# Altium schematic sheet Audio_Input_Digitial_Mic.SchDoc: MEMS Microphones
size 279 x 215 mm; DrawnBy: Connor Dack; Engineer: Connor Dack; DocumentNumber: 10; Revision: 1.0; SheetNumber: 10; SheetTotal: 11
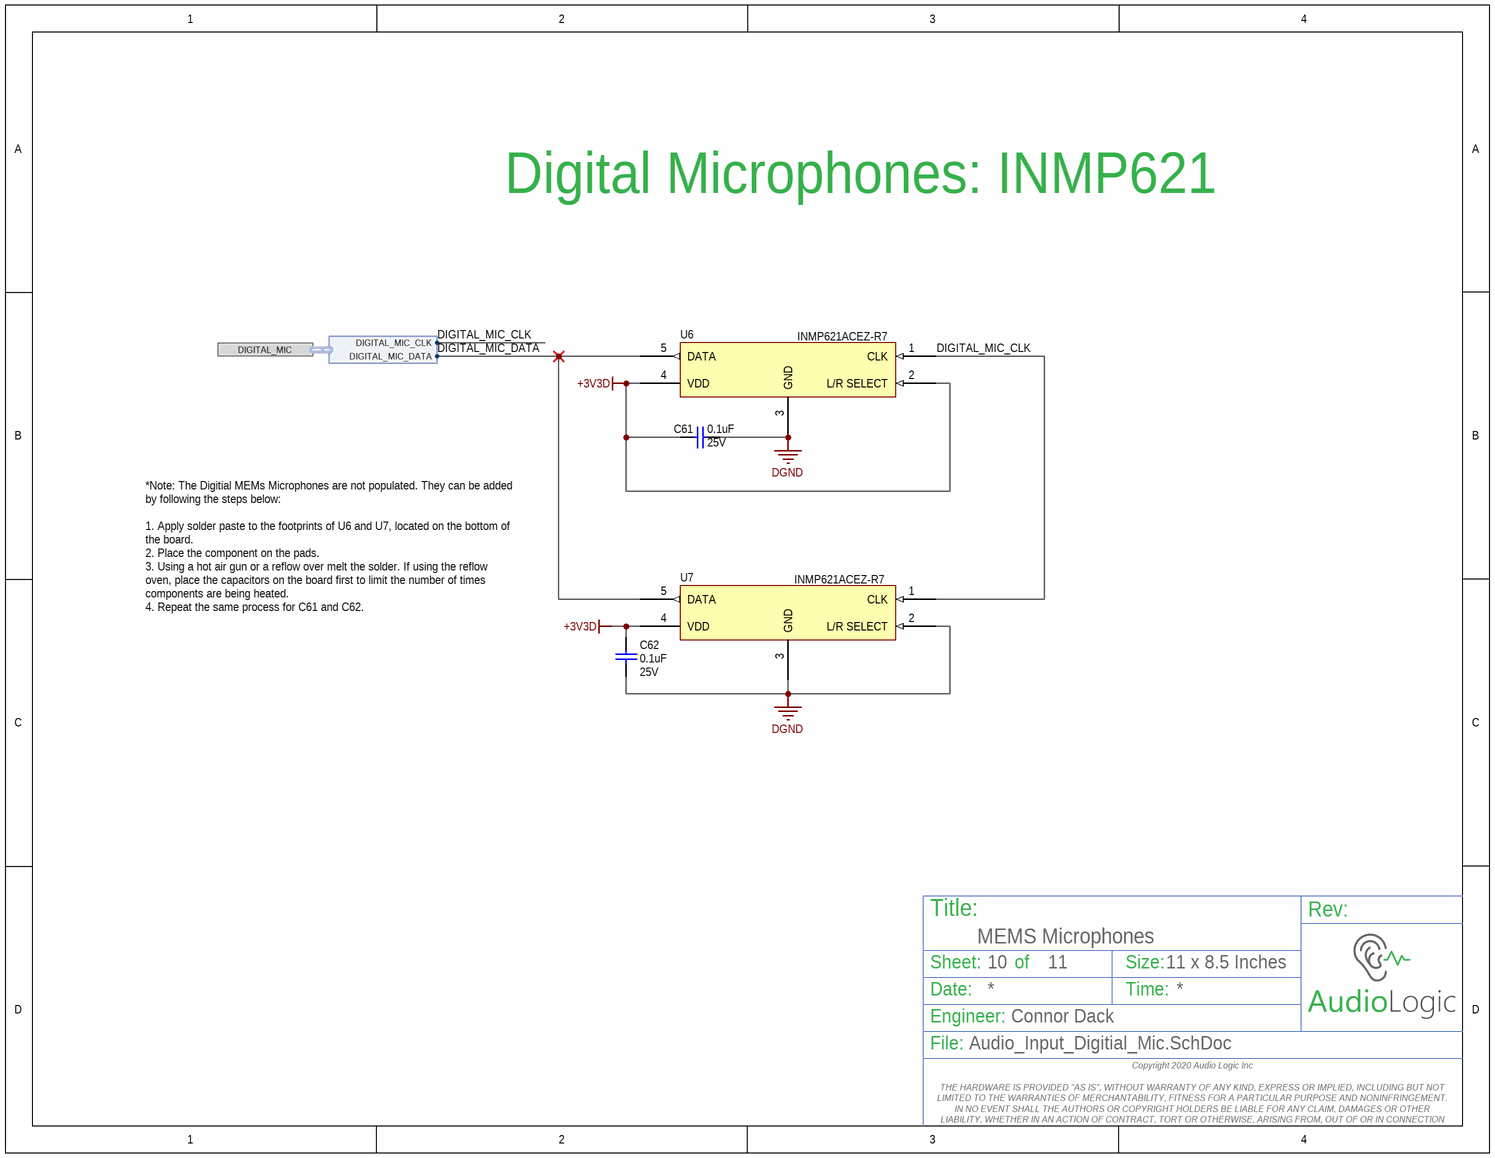
[diagram p0: Audio_Input_Digitial_Mic.SchDoc]

## Parts
C61  Voltage Rating: 25V  Capacitance: 0.1uF  [3-0603_L_DNP]  (hidden comment: CGA3E2X7R1E104K080AA)
C62  Voltage Rating: 25V  Capacitance: 0.1uF  [3-0603_L_DNP]  (hidden comment: CGA3E2X7R1E104K080AA)
U6  Manufacturer Part Number: INMP621ACEZ-R7  [INMP621_DNP]  (hidden comment: INMP621)
U7  Manufacturer Part Number: INMP621ACEZ-R7  [INMP621_DNP]  (hidden comment: INMP621)

## Ports
DIGITAL_MIC (harness Digital_Mic)

## Harnesses
Digital_Mic: DIGITAL_MIC_CLK, DIGITAL_MIC_DATA

## Nets
+3V3D: C61.2 C62.1 U6.2(L/R_SELECT) U6.4(VDD) U7.4(VDD)
DGND: C61.1 C62.2 U6.3(GND) U7.2(L/R_SELECT) U7.3(GND)
DIGITAL_MIC_CLK: U6.1(CLK) U7.1(CLK) ; port DIGITAL_MIC.DIGITAL_MIC_CLK
DIGITAL_MIC_DATA: U6.5(DATA) U7.5(DATA) ; port DIGITAL_MIC.DIGITAL_MIC_DATA

## Notes on the sheet
- Digital Microphones: INMP621
- *Note: The Digitial MEMs Microphones are not populated. They can be added by following the steps below:
  1. Apply solder paste to the footprints of U6 and U7, located on the bottom of the board.
  2. Place the component on the pads.
  3. Using a hot air gun or a reflow over melt the solder. If using the reflow oven, place the capacitors on the board first to limit the number of times components are being heated.
  4. Repeat the same process for C61 and C62.
- Title:
- Sheet:
- of
- Size:
- 11 x 8.5 Inches
- Rev:
- Date:
- Engineer:
- Time:
- File:
- Copyright 2020 Audio Logic Inc
  THE HARDWARE IS PROVIDED "AS IS", WITHOUT WARRANTY OF ANY KIND, EXPRESS OR IMPLIED, INCLUDING BUT NOT LIMITED TO THE WARRANTIES OF MERCHANTABILITY, FITNESS FOR A PARTICULAR PURPOSE AND NONINFRINGEMENT. IN NO EVENT SHALL THE AUTHORS OR COPYRIGHT HOLDERS BE LIABLE FOR ANY CLAIM, DAMAGES OR OTHER LIABILITY, WHETHER IN AN ACTION OF CONTRACT, TORT OR OTHERWISE, ARISING FROM, OUT OF OR IN CONNECTION WITH THE HARDWARE OR THE USE OR OTHER DEALINGS IN THE HARDWARE.

## Library data of the parts
C61 C62 = CGA3E2X7R1E104K080AA: CAP CER 0.1UF 25V X7R 0603; Manufacturer: TDK; Tolerance: 10%; ComponentLink1URL: https://datasheet.ciiva.com/24218/cga3e2x7r1h332k080aa-266003-24218741.pdf; ComponentLink1Description: https://datasheet.ciiva.com/24218/cga3e2x7r1h332k080aa-266003-24218741.pdf; Supplier 1: Digi-Key; Manufacturer Part Number: CGA3E2X7R1E104K080AA; Stock 1: 170098; Pricing 1: 1=0.1, 10=0.063, 100=0.0279, 500=0.0199, 1000=0.0156 (USD); Mount: Surface Mount; Case/Package: 0603; Weight: 7.1E-05oz; Case Code (Metric): 1608; Case Code (Imperial): 0603; Min Operating Temperature: -55°C; Max Operating Temperature: 125°C; Packaging: Tape and Reel; Package Quantity: 1; Voltage Rating (DC): 25V; Dielectric: X7R; Termination: SMD/SMT; Composition: Ceramic; Length: 1.6mm; Height: 0.8mm; Width: 0.031inch; Thickness: 0.035inch; Depth: 0.8mm; REACH SVHC: No SVHC; Lead Free: Lead Free; ComponentLink2URL: https://datasheet.ciiva.com/22725/1735392-22725638.pdf; ComponentLink2Description: https://datasheet.ciiva.com/22725/1735392-22725638.pdf; ComponentLink3URL: https://datasheet.ciiva.com/24220/cga3e2x7r1e104k080aa-265934-24220022.pdf; ComponentLink3Description: https://datasheet.ciiva.com/24220/cga3e2x7r1e104k080aa-265934-24220022.pdf; ComponentLink4URL: https://datasheet.ciiva.com/22725/1735392-22725639.pdf; ComponentLink4Description: https://datasheet.ciiva.com/22725/1735392-22725639.pdf; ComponentLink5URL: https://datasheet.ciiva.com/16427/mlccspec-automotive-general-midvoltage-en-16427320.pdf; ComponentLink5Description: https://datasheet.ciiva.com/16427/mlccspec-automotive-general-midvoltage-en-16427320.pdf; ComponentLink6URL: https://datasheet.ciiva.com/23803/1735392-23803082.pdf; ComponentLink6Description: https://datasheet.ciiva.com/23803/1735392-23803082.pdf; Supplier Part Number 1: 445-5667-6-ND; Load Status: *
U6 U7 = INMP621: 45Hz ~ 20kHz Digital, PDM Microphone MEMS (Silicon) Omnidirectional (-46dB ±2dB @ 94dB SPL) Solder Pads; Manufacturer: InvenSense; S/N Ratio: 65dB; Voltage Range: 1.62 ~ 3.63V; Current - Supply: 1.6mA; Port Location: Bottom; Seal Rating: None; Shape: Rectangular; Supplier 1: Digi-Key; RoHS: RoHS Compliant; Category: Audio Products; Stock 1: 1211; Pricing 1: 1=2.88, 10=2.491, 25=2.2292, 50=1.9668, 100=1.9012, 250=1.83568, 500=1.77012 (USD); Packaging: Cut Tape (CT); Part Status: Active; Type: MEMS (Silicon); Output Type: Digital, PDM; Direction: Omnidirectional; Frequency Range: 45Hz ~ 20kHz; Sensitivity: -46dB ±2dB @ 94dB SPL; Impedance: -; Voltage - Rated: -; Termination: Solder Pads; Size / Dimension: 4.00mm L x 3.00mm W; Height (Max): 1.10mm; ComponentLink1URL: https://www.invensense.com/wp-content/uploads/2015/02/INMP621.pdf; ComponentLink1Description: https://www.invensense.com/wp-content/uploads/2015/02/INMP621.pdf; Supplier Part Number 1: 1428-1018-1-ND; Load Status: *